# Altium project DATN_Project.PrjPcb
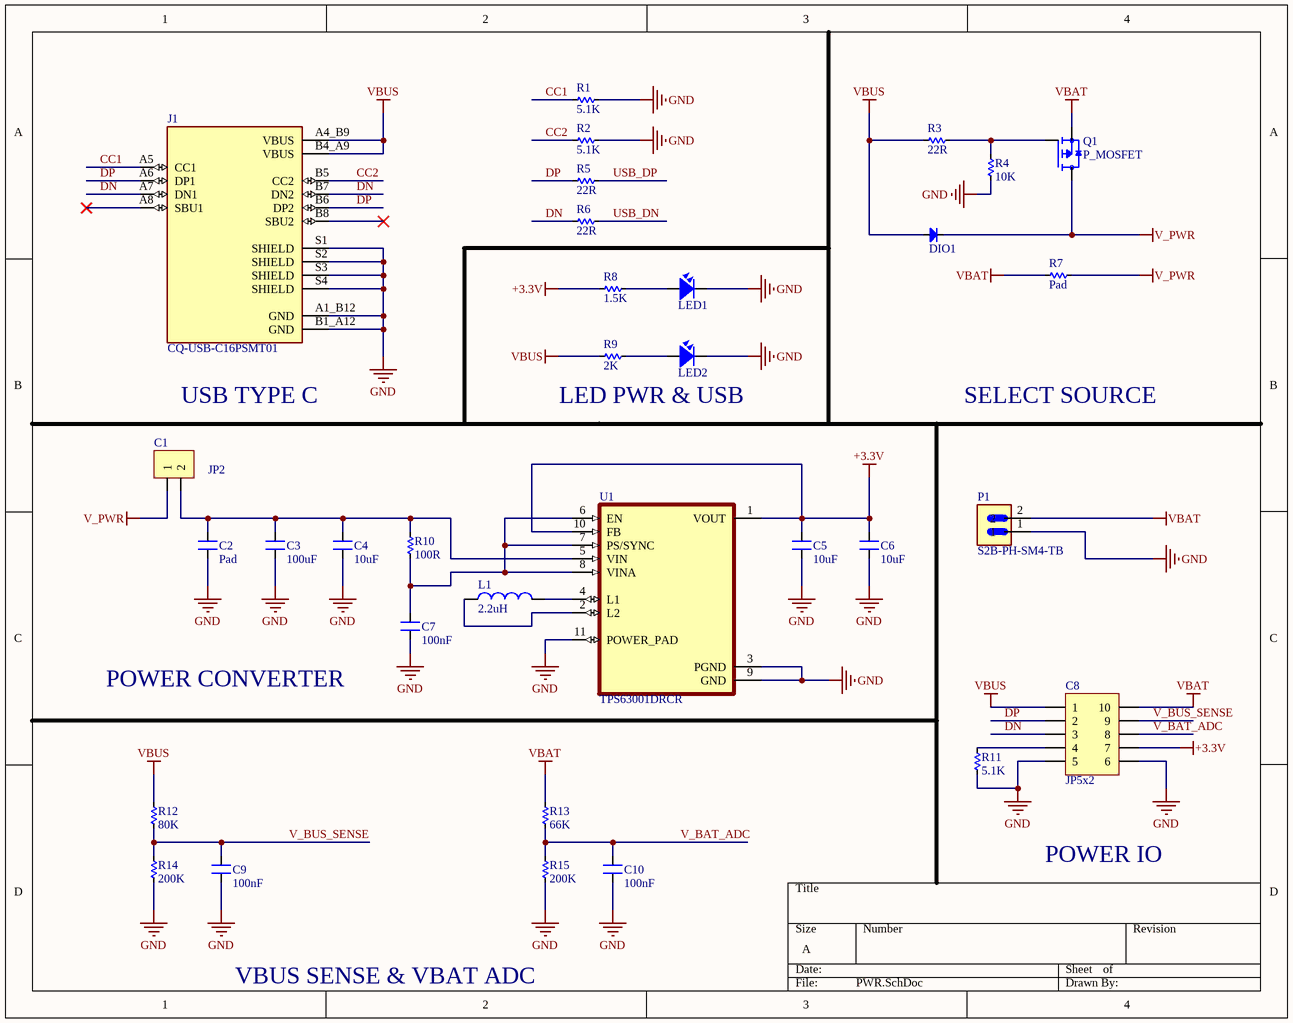
[diagram p0: PWR.SchDoc]
3 sheets, 103 parts. Net scope: global (net labels, ports and power ports of the same name join across sheets).
Board file: DATN_PCB_ver1.PcbDoc
Sheets:
  PWR.SchDoc
  MCU.SchDoc
  GPS_LORA_IMU.SchDoc

## Sheet PWR.SchDoc
size A; SheetNumber: 1; SheetTotal: 3

### Parts
C1  JP2  [JP2-CLOSED]
C2  Pad  [PAD-SMD-1206]
C3  100uF  [CN-SMD-1206]
C4  10uF  [CN-SMD-1206]
C5  10uF  [CN-SMD-1206]
C6  10uF  [CN-SMD-1206]
C7  100nF  [CN-SMD-0603]
C8  JP5x2  [JP5-D2T]
C9  100nF  [CN-SMD-0603]
C10  100nF  [CN-SMD-0603]
DIO1  Diode SMD  [DIO-SMD-123]  (value not drawn)
J1  CQ-USB-C16PSMT01  [SHENZHEN-CHUANGQIN-TECHNOLOGY_CQ-USB-C16PSMT01]
L1  2.2uH  [INDC6060X300]
LED1  LED GREEN  [LED-0805-Green]  (value not drawn)
LED2  LED GREEN  [LED-0805-Blue]  (value not drawn)
P1  S2B-PH-SM4-TB  [JST_S2B-PH-SM4-TB]
Q1  P_MOSFET  [P_MOSFET_SOT23]
R1  5.1K  [RES-SMD-0603]
R2  5.1K  [RES-SMD-0603]
R3  22R  [RES-SMD-0603]
R4  10K  [RES-SMD-0603]
R5  22R  [RES-SMD-0603]
R6  22R  [RES-SMD-0603]
R7  Pad  [PAD-SMD-1206]
R8  1.5K  [RES-SMD-0603]
R9  2K  [RES-SMD-0603]
R10  100R  [RES-SMD-0603]
R11  5.1K  [RES-SMD-0603]
R12  80K  [RES-SMD-0603]
R13  66K  [RES-SMD-0603]
R14  200K  [RES-SMD-0603]
R15  200K  [RES-SMD-0603]
U1  TPS63001DRCR  [VREG_V62/16624-01YE]

### Nets
+3.3V: C5.2 C6.2 C8.7 R8.2 U1.1(VOUT) U1.10(FB)  [project net 3.3V_OUT]
GND: C2.1 C3.1 C4.1 C5.1 C6.1 C7.1 C8.5 C8.6 C9.1 C10.1 J1.A1_B12(GND) J1.B1_A12(GND) J1.S1(SHIELD) J1.S2(SHIELD) J1.S3(SHIELD) J1.S4(SHIELD) LED1.2 LED2.2 P1.1 R1.1 R2.1 R4.2 R11.2 R14.1 R15.1 U1.3(PGND) U1.9(GND) U1.11(POWER_PAD)  [project net GND_OUT]
V_PWR: C1.1 DIO1.2(K) Q1.3(D) R7.2
VBAT: C8.10 P1.2 Q1.2(S) R7.1 R13.2
VBUS: C8.1 DIO1.1(A) J1.A4_B9(VBUS) J1.B4_A9(VBUS) R3.2 R9.2 R12.2
CC1: J1.A5(CC1) R1.2
CC2: J1.B5(CC2) R2.2
DN: C8.3 J1.A7(DN1) J1.B7(DN2) R6.2
DP: C8.2 J1.A6(DP1) J1.B6(DP2) R5.2
USB_DN: R6.1
USB_DP: R5.1
V_BAT_ADC: C8.8 C10.2 R13.1 R15.2
V_BUS_SENSE: C8.9 C9.2 R12.1 R14.2
NetC1_2: C1.2 C2.2 C3.2 C4.2 R10.1 U1.5(VIN)
NetC7_2: C7.2 R10.2 U1.6(EN) U1.7(PS/SYNC) U1.8(VINA)
NetC8_4: C8.4 R11.1
NetL1_1: L1.1 U1.2(L2)
NetL1_2: L1.2 U1.4(L1)
NetLED1_1: LED1.1 R8.1
NetLED2_1: LED2.1 R9.1
NetQ1_1: Q1.1(G) R3.1 R4.1

Not connected (* = marked no-connect by the designer): J1 A8(SBU1)* B8(SBU2)*

### Notes on the sheet
- USB TYPE C
- LED PWR & USB
- SELECT SOURCE
- POWER CONVERTER
- POWER IO
- VBUS SENSE & VBAT ADC

### Library data of the parts
C1 = JP2: WR-PHD 2.54 mm Angled Socket Header; Manufacturer: W¨¹rth Elektronik eiSos GmbH; partNo: 613002143121; ComponentLink1 Description: Manufacturer; ComponentLink2 Description: Datasheet; NoPins: 02; Created Date: 29 March 2013; ComponentLink1URL: http://www.we-online.com; ComponentLink2URL: http://katalog.we-online.de/em/datasheet/6130xx143121.pdf; Created by: Karrer Zheng
C2-C7 C9 C10 = Cap-SMD: Value: 33pF
C8 = JP5x2: WR-PHD 2.54 mm Dual Socket Header; Manufacturer: W¨¹rth Elektronik eiSos GmbH; partNo: 61301021821; ComponentLink1 Description: Manufacturer; ComponentLink2 Description: Datasheet; NoPins: 10; Created Date: 29 March 2013; ComponentLink1URL: http://www.we-online.com; ComponentLink2URL: http://katalog.we-online.de/em/datasheet/6130xx21821.pdf; Created by: Karrer Zheng
DIO1 = Diode SMD: Default Diode; Code - JEDEC: DO-214-AB; Value: 1N5007; Published: 8-Jun-2000; Revision: July-2002: Re-released for DXP Platform.; Publisher: Altium Limited
J1 = CQ-USB-C16PSMT01: C Type USB Type-C Female Plug 16 Pin Connector Power Charger Jack Port; MF: Shenzen Chuangqin Technology; SnapEDA_Link: https://www.snapeda.com/parts/CQ-USB-C16PSMT01/Shenzen+Chuangqin+Technology/view-part/?ref=snap; Package: Package; Value: *; MP: CQ-USB-C16PSMT01; Check_prices: https://www.snapeda.com/parts/CQ-USB-C16PSMT01/Shenzen+Chuangqin+Technology/view-part/?ref=eda
L1 = SMD-Wire-Inductor: INDUCTOR wire-wound; MP: LQW2BAN68NG00L; Package: None; Price: None; Value: *; Availability: Unavailable
LED1 LED2 = LED SMD: Value: LED 3 - 5 ly 2 Colour
P1 = S2B-PH-SM4-TB: Connector Header Surface Mount, Right Angle 2 position 0.079 (2.00mm); MF: JST Sales; SnapEDA_Link: https://www.snapeda.com/parts/S2B-PH-SM4-TB/JST/view-part/?ref=snap; Package: None; Value: *; MP: S2B-PH-SM4-TB; Check_prices: https://www.snapeda.com/parts/S2B-PH-SM4-TB/JST/view-part/?ref=eda
Q1 = P_MOSFET: MF: Diotec Semiconductor; MP: MMFTP3401; SnapEDA_Link: https://www.snapeda.com/parts/MMFTP3401/Diotec/view-part/?ref=snap; Package: SOT-23 Diotec; Value: *; Check_prices: https://www.snapeda.com/parts/MMFTP3401/Diotec/view-part/?ref=eda
R1-R15 = Res-SMD: Resistor; Manufacturer: Generic Components; Class: Passive; Published: 08/06/2000; Publisher: Altium Hobart Technology Centre
U1 = TPS63001DRCR: 96% Buck-Boost Converter with 1.7A Current Switches, 3.3V fixed Output voltage in 3x3 QFN; MF: Texas Instruments; SnapEDA_Link: https://www.snapeda.com/parts/TPS63001DRCR/Texas+Instruments/view-part/?ref=snap; Package: VSON-10 Texas Instruments; Value: *; MP: TPS63001DRCR; Check_prices: https://www.snapeda.com/parts/TPS63001DRCR/Texas+Instruments/view-part/?ref=eda

## Sheet MCU.SchDoc
size A; SheetNumber: 2; SheetTotal: 3
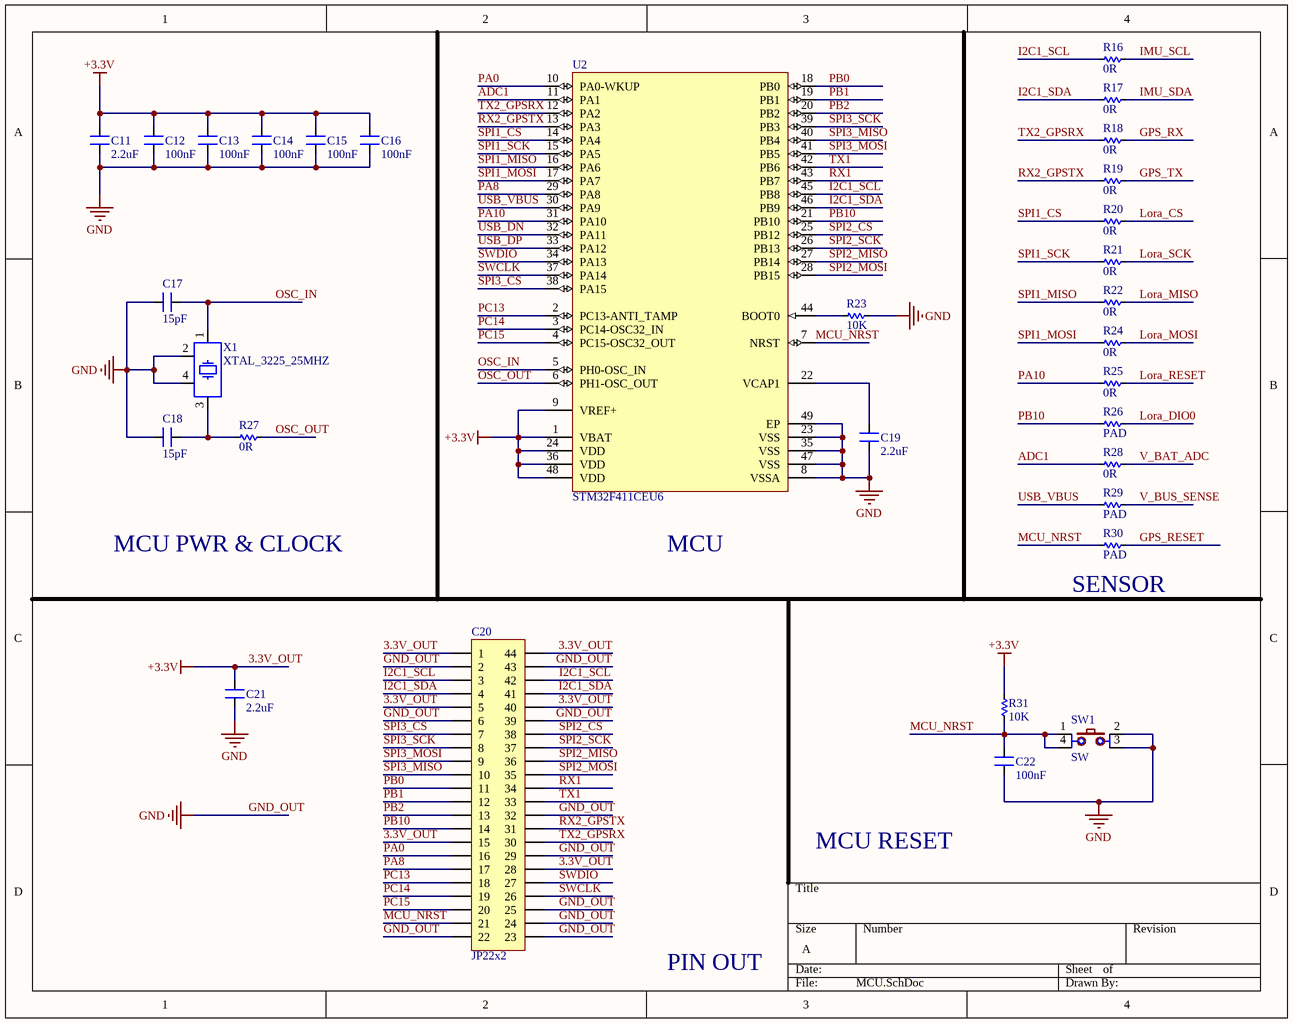
[diagram p1: MCU.SchDoc]

### Parts
C11  2.2uF  [CN-SMD-0805]
C12  100nF  [CN-SMD-0603]
C13  100nF  [CN-SMD-0603]
C14  100nF  [CN-SMD-0603]
C15  100nF  [CN-SMD-0603]
C16  100nF  [CN-SMD-0603]
C17  15pF  [CN-SMD-0603]
C18  15pF  [CN-SMD-0603]
C19  2.2uF  [CN-SMD-0805]
C20  JP22x2  [JP22-D2T]
C21  2.2uF  [CN-SMD-0805]
C22  100nF  [CN-SMD-0603]
R16  0R  [RES-SMD-0603]
R17  0R  [RES-SMD-0603]
R18  0R  [RES-SMD-0603]
R19  0R  [RES-SMD-0603]
R20  0R  [RES-SMD-0603]
R21  0R  [RES-SMD-0603]
R22  0R  [RES-SMD-0603]
R23  10K  [RES-SMD-0603]
R24  0R  [RES-SMD-0603]
R25  0R  [RES-SMD-0603]
R26  PAD  [PAD-RES-SMD-0603]
R27  0R  [RES-SMD-0603]
R28  0R  [RES-SMD-0603]
R29  PAD  [PAD-RES-SMD-0603]
R30  PAD  [PAD-RES-SMD-0603]
R31  10K  [RES-SMD-0603]
SW1  SW  [SW2-SMD]
U2  STM32F411CEU6  [STM-UFQFPN48_L]
X1  XTAL_3225_25MHZ  [XTAL_3225]

### Nets
3.3V_OUT: C11.2 C12.2 C13.2 C14.2 C15.2 C16.2 C20.1 C20.5 C20.15 C20.28 C20.40 C20.44 C21.2 R31.1 U2.1(VBAT) U2.9(VREF+) U2.24(VDD) U2.36(VDD) U2.48(VDD)  [also labelled +3.3V]
GND_OUT: C11.1 C12.1 C13.1 C14.1 C15.1 C16.1 C17.2 C18.2 C19.1 C20.2 C20.6 C20.22 C20.23 C20.24 C20.25 C20.29 C20.32 C20.39 C20.43 C21.1 C22.1 R23.2 SW1.2 SW1.3 U2.8(VSSA) U2.23(VSS) U2.35(VSS) U2.47(VSS) U2.49(EP) X1.2 X1.4  [also labelled GND]
ADC1: R28.1 U2.11(PA1)
GPS_RESET: R30.2
GPS_RX: R18.2
GPS_TX: R19.2
I2C1_SCL: C20.3 C20.42 R16.1 U2.45(PB8)
I2C1_SDA: C20.4 C20.41 R17.1 U2.46(PB9)
IMU_SCL: R16.2
IMU_SDA: R17.2
Lora_CS: R20.2
Lora_DIO0: R26.2
Lora_MISO: R22.2
Lora_MOSI: R24.2
Lora_RESET: R25.2
Lora_SCK: R21.2
MCU_NRST: C20.21 C22.2 R30.1 R31.2 SW1.1 SW1.4 U2.7(NRST)
OSC_IN: C17.1 U2.5(PH0-OSC_IN) X1.1
OSC_OUT: R27.2 U2.6(PH1-OSC_OUT)
PA0: C20.16 U2.10(PA0-WKUP)
PA8: C20.17 U2.29(PA8)
PA10: R25.1 U2.31(PA10)
PB0: C20.11 U2.18(PB0)
PB1: C20.12 U2.19(PB1)
PB2: C20.13 U2.20(PB2)
PB10: C20.14 R26.1 U2.21(PB10)
PC13: C20.18 U2.2(PC13-ANTI_TAMP)
PC14: C20.19 U2.3(PC14-OSC32_IN)
PC15: C20.20 U2.4(PC15-OSC32_OUT)
RX1: C20.34 U2.43(PB7)
RX2_GPSTX: C20.31 R19.1 U2.13(PA3)
SPI1_CS: R20.1 U2.14(PA4)
SPI1_MISO: R22.1 U2.16(PA6)
SPI1_MOSI: R24.1 U2.17(PA7)
SPI1_SCK: R21.1 U2.15(PA5)
SPI2_CS: C20.38 U2.25(PB12)
SPI2_MISO: C20.36 U2.27(PB14)
SPI2_MOSI: C20.35 U2.28(PB15)
SPI2_SCK: C20.37 U2.26(PB13)
SPI3_CS: C20.7 U2.38(PA15)
SPI3_MISO: C20.10 U2.40(PB4)
SPI3_MOSI: C20.9 U2.41(PB5)
SPI3_SCK: C20.8 U2.39(PB3)
SWCLK: C20.26 U2.37(PA14)
SWDIO: C20.27 U2.34(PA13)
TX1: C20.33 U2.42(PB6)
TX2_GPSRX: C20.30 R18.1 U2.12(PA2)
USB_DN: U2.32(PA11)
USB_DP: U2.33(PA12)
USB_VBUS: R29.1 U2.30(PA9)
V_BAT_ADC: R28.2
V_BUS_SENSE: R29.2
NetC18_1: C18.1 R27.1 X1.3
NetC19_2: C19.2 U2.22(VCAP1)
NetR23_1: R23.1 U2.44(BOOT0)

### Notes on the sheet
- MCU PWR & CLOCK
- MCU
- (near R30) SENSOR
- MCU RESET
- PIN OUT

### Library data of the parts
C11-C19 C21 C22 = Cap-SMD: Value: 33pF
C20 = JP22x2: WR-PHD 2.54 mm Dual Socket Header; Manufacturer: W¨¹rth Elektronik eiSos GmbH; partNo: 61304421821; ComponentLink1 Description: Manufacturer; ComponentLink2 Description: Datasheet; NoPins: 44; Created Date: 29 March 2013; ComponentLink1URL: http://www.we-online.com; ComponentLink2URL: http://katalog.we-online.de/em/datasheet/6130xx21821.pdf; Created by: Karrer Zheng
R16-R31 = Res-SMD: as R1 on sheet PWR; Published: 08/06/2000; Publisher: Altium Hobart Technology Centre
SW1 = SW4: Switch button 4 pin; Value: Button chip 4 pin
U2 = STM32F411CEU6: ARM Cortex-M4 32-bit MCU+FPU, 512 KB Flash, 128 KB RAM, 36 I/Os, 48-Pin UFQFPN, -40 to 85 degC, Tray; Operating Frequency(F) (Processor speed) (MHz): 100; FLASH Size (Prog) (kB): 512; Internal RAM Size (kB): 128; I/Os (High Current): 36; Supply Voltage(Vcc) min (V): 1.7; Package Reference: 48-Pin Ultra Thin Fine Pitch Quad Flat No-Lead, 7 x 7 x 0.6 mm Body, 0.5 mm Pitch, Exposed Pad; ComponentLink1Description: Manufacturer URL; ComponentLink1URL: http://www.st.com/; Packing: Tray; Package Description: UFQFPN48; Core: ARM Cortex-M4; ComponentLink2Description: Datasheet; ComponentLink2URL: http://www.st.com/st-web-ui/static/active/en/resource/technical/document/datasheet/DM00115249.pdf; DatasheetVersion: Rev. 6; Mounting Technology: Surface Mount
X1 = XTAL 4 Pin: Crystal Oscillator; Distributor Link: *

## Sheet GPS_LORA_IMU.SchDoc
size A; SheetNumber: 3; SheetTotal: 3
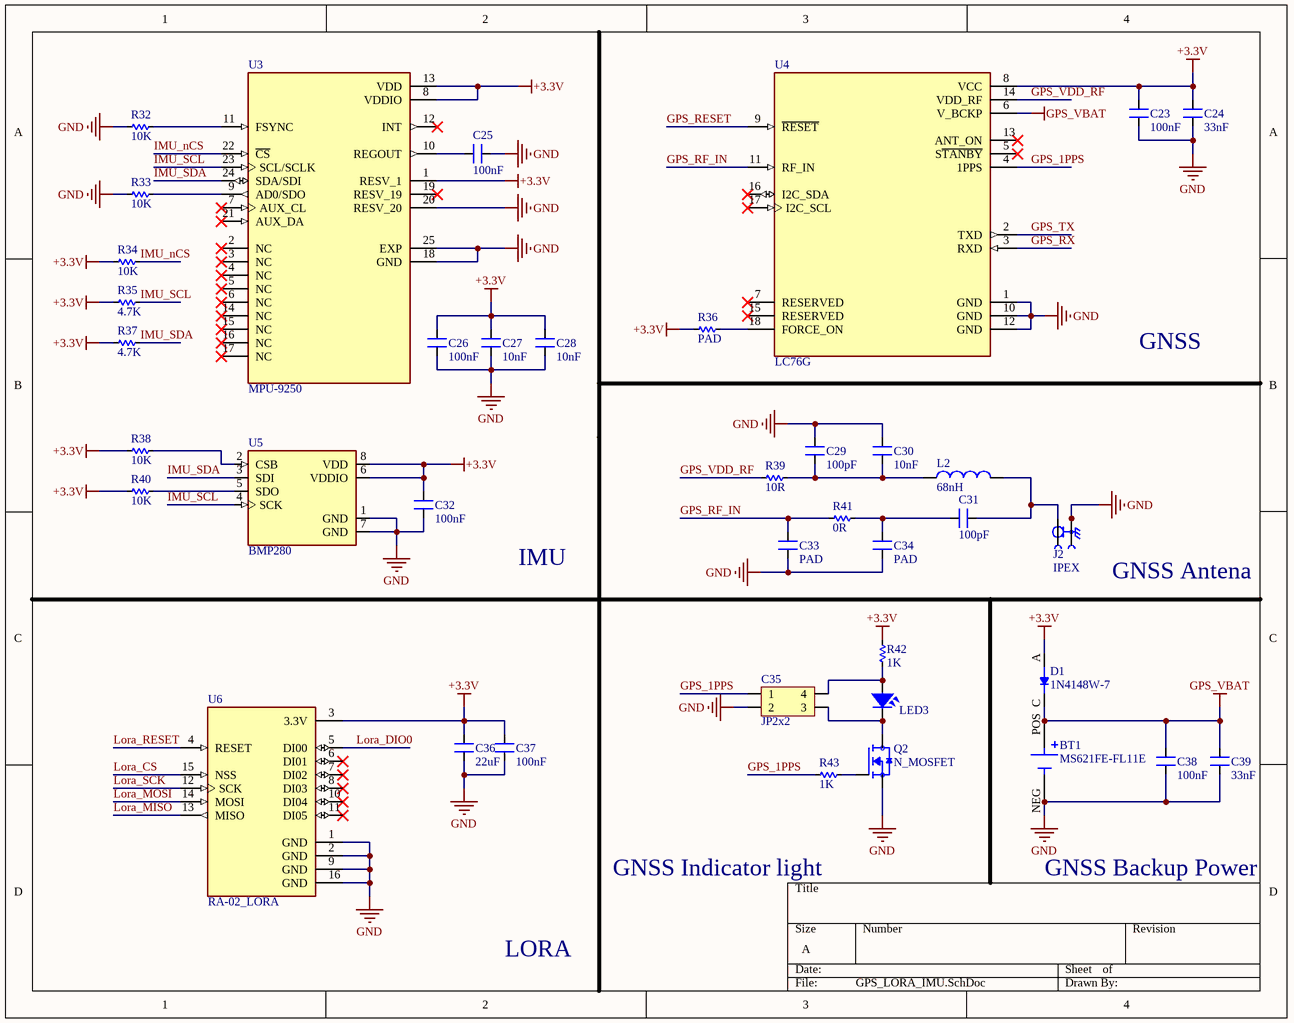
[diagram p2: GPS_LORA_IMU.SchDoc]

### Parts
BT1  MS621FE-FL11E  [BAT_MS621FE-FL11E]
C23  100nF  [CN-SMD-0603]
C24  33nF  [CN-SMD-0603]
C25  100nF  [CN-SMD-0603]
C26  100nF  [CN-SMD-0603]
C27  10nF  [CN-SMD-0603]
C28  10nF  [CN-SMD-0603]
C29  100pF  [CN-SMD-0603]
C30  10nF  [CN-SMD-0603]
C31  100pF  [CN-SMD-0603]
C32  100nF  [CN-SMD-0603]
C33  PAD  [PAD-CAP-SMD-0603]
C34  PAD  [PAD-CAP-SMD-0603]
C35  JP2x2  [JP2-D2T]
C36  22uF  [CN-SMD-1206]
C37  100nF  [CN-SMD-0603]
C38  100nF  [CN-SMD-0603]
C39  33nF  [CN-SMD-0603]
D1  1N4148W-7  [SOD3715X135N]
J2  IPEX  [IPEX_20279-001E-03]
L2  68nH  [SMD_Inductor_0603]
LED3  LED  [LED-0805-Green]  (value not drawn)
Q2  N_MOSFET  [SOT-23-3]
R32  10K  [RES-SMD-0603]
R33  10K  [RES-SMD-0603]
R34  10K  [RES-SMD-0603]
R35  4.7K  [RES-SMD-0603]
R36  PAD  [PAD-RES-SMD-0603]
R37  4.7K  [RES-SMD-0603]
R38  10K  [RES-SMD-0603]
R39  10R  [RES-SMD-0603]
R40  10K  [RES-SMD-0603]
R41  0R  [RES-SMD-0603]
R42  1K  [RES-SMD-0603]
R43  1K  [RES-SMD-0603]
U3  MPU-9250  [QFN40P300X300X105-25N]
U4  LC76G  [XCVR_LC76G]
U5  BMP280  [XDCR_BMP280]
U6  RA-02_LORA  [MODULE_RA-02_LORA]

### Nets
+3.3V: C23.2 C24.2 C26.2 C27.2 C28.2 C32.2 C36.2 C37.2 D1.A R34.1 R35.1 R36.2 R37.1 R38.2 R40.2 R42.2 U3.1(RESV_1) U3.8(VDDIO) U3.13(VDD) U4.8(VCC) U5.6(VDDIO) U5.8(VDD) U6.3(3.3V)  [project net 3.3V_OUT]
GND: BT1.NEG C23.1 C24.1 C25.2 C26.1 C27.1 C28.1 C29.2 C30.2 C32.1 C33.2 C34.2 C35.2 C36.1 C37.1 C38.1 C39.1 J2.2(GROUND) J2.3(GROUND) Q2.2(S) R32.2 R33.2 U3.18(GND) U3.20(RESV_20) U3.25(EXP) U4.1(GND) U4.10(GND) U4.12(GND) U5.1(GND) U5.7(GND) U6.1(GND) U6.2(GND) U6.9(GND) U6.16(GND)  [project net GND_OUT]
GPS_VBAT: BT1.POS C38.2 C39.2 D1.C(K) U4.6(V_BCKP)
GPS_1PPS: C35.1 R43.1 U4.4(1PPS)
GPS_RESET: U4.9(~{RESET})
GPS_RF_IN: C33.1 R41.2 U4.11(RF_IN)
GPS_RX: U4.3(RXD)
GPS_TX: U4.2(TXD)
GPS_VDD_RF: R39.2 U4.14(VDD_RF)
IMU_nCS: R34.2 U3.22(~{CS})
IMU_SCL: R35.2 U3.23(SCL/SCLK) U5.4(SCK)
IMU_SDA: R37.2 U3.24(SDA/SDI) U5.3(SDI)
Lora_CS: U6.15(NSS)
Lora_DIO0: U6.5(DI00)
Lora_MISO: U6.13(MISO)
Lora_MOSI: U6.14(MOSI)
Lora_RESET: U6.4(RESET)
Lora_SCK: U6.12(SCK)
NetC25_1: C25.1 U3.10(REGOUT)
NetC29_1: C29.1 C30.1 L2.1 R39.1
NetC31_1: C31.1 J2.1(SIGNAL) L2.2
NetC31_2: C31.2 C34.1 R41.1
NetC35_3: C35.3 LED3.2 Q2.3(D)
NetC35_4: C35.4 LED3.1 R42.1
NetQ2_1: Q2.1(G) R43.2
NetR32_1: R32.1 U3.11(FSYNC)
NetR33_1: R33.1 U3.9(AD0/SDO)
NetR36_1: R36.1 U4.18(FORCE_ON)
NetR38_1: R38.1 U5.2(CSB)
NetR40_1: R40.1 U5.5(SDO)

Not connected (* = marked no-connect by the designer): U3 2(NC)* 3(NC)* 4(NC)* 5(NC)* 6(NC)* 7(AUX_CL)* 12(INT)* 14(NC)* 15(NC)* 16(NC)* 17(NC)* 19(RESV_19)* 21(AUX_DA)*; U4 5(S~{TANBY})* 7(RESERVED)* 13(ANT_ON)* 15(RESERVED)* 16(I2C_SDA)* 17(I2C_SCL)*; U6 6(DI01)* 7(DI02)* 8(DI03)* 10(DI04)* 11(DI05)*

### Notes on the sheet
- GNSS
- IMU
- (near J2) GNSS Antena
- GNSS Indicator light
- GNSS Backup Power
- LORA

### Library data of the parts
BT1 = MS621FE-FL11E: Coin, 6.8mm 3 V Lithium Battery Rechargeable (Secondary) 5.5mAh; MF: Seiko Instruments; Value: *; Purchase-URL: https://pricing.snapeda.com/search/part/MS621FE-FL11E/?ref=eda; Package: QFP-128 Seiko; Availability: In Stock; Check_prices: https://www.snapeda.com/parts/MS621FE-FL11E/Seiko+Instruments/view-part/?ref=eda; Price: None; SnapEDA_Link: https://www.snapeda.com/parts/MS621FE-FL11E/Seiko+Instruments/view-part/?ref=snap; MP: MS621FE-FL11E
C23-C34 C36-C39 = Cap-SMD: Value: 33pF
C35 = JP2x2: WR-PHD 2.54 mm Dual Socket Header; Manufacturer: W¨¹rth Elektronik eiSos GmbH; partNo: 61300421821; ComponentLink1 Description: Manufacturer; ComponentLink2 Description: Datasheet; NoPins: 04; Created Date: 29 March 2013; ComponentLink1URL: http://www.we-online.com; ComponentLink2URL: http://katalog.we-online.de/em/datasheet/6130xx21821.pdf; Created by: Karrer Zheng
D1 = 1N4148W-7: Diode Standard 100 V 300mA (DC) Surface Mount SOD-123; MF: Diodes Inc.; SnapEDA_Link: https://www.snapeda.com/parts/1N4148W-7/Diodes+Inc./view-part/?ref=snap; Package: SOD-123 Fairchild Semiconductor; MP: 1N4148W-7; Check_prices: https://www.snapeda.com/parts/1N4148W-7/Diodes+Inc./view-part/?ref=eda; Purchase-URL: https://pricing.snapeda.com/search/part/1N4148W-7/?ref=eda; Price: None; Value: *; Availability: In Stock
J2 = IPEX: 1 POS Vertical SMD Small form factor with big performance through 6 GHz connector,MHF, RF, micro-coaxial MHF I Receptacle; MF: I-PEX; MP: 20279-001E-03; SnapEDA_Link: https://www.snapeda.com/parts/20279-001E-03/I-PEX/view-part/?ref=snap; Package: None; Value: *; Check_prices: https://www.snapeda.com/parts/20279-001E-03/I-PEX/view-part/?ref=eda
L2 = SMD-Wire-Inductor: INDUCTOR wire-wound; MP: LQW2BAN68NG00L; Package: None; Price: None; Value: *; Availability: Unavailable
LED3 = LED SMD: Value: LED 3 - 5 ly 2 Colour
Q2 = N_MOSFET: MF: Vishay Siliconix; MP: SI2306BDS-T1-GE3; SnapEDA_Link: https://www.snapeda.com/parts/SI2306BDS-T1-GE3/Vishay/view-part/?ref=snap; Package: SOT-23-3 Vishay Siliconix; Value: *; Check_prices: https://www.snapeda.com/parts/SI2306BDS-T1-GE3/Vishay/view-part/?ref=eda
R32-R35 R37 R38 R40 = Res-SMD: Manufacturer: Generic Components; Class: Passive; Published: 08/06/2000; Publisher: Altium Hobart Technology Centre
R36 R39 R41-R43 = Res-SMD: as R1 on sheet PWR; Published: 08/06/2000; Publisher: Altium Hobart Technology Centre
U3 = MPU-9250: MPU-9250 series Accelerometer, Gyroscope, Humidity, Magnetometer, Pressure, Temperature Sensor Evaluation Board; MF: TDK InvenSense; SnapEDA_Link: https://www.snapeda.com/parts/MPU-9250/TDK+InvenSense/view-part/?ref=snap; Package: TFQFN-24 TDK InvenSense; Value: *; MP: MPU-9250; Check_prices: https://www.snapeda.com/parts/MPU-9250/TDK+InvenSense/view-part/?ref=eda
U4 = LC76G: MF: Quectel; Package: None; Price: None; Value: *; MP: LC76G; Availability: Unavailable
U5 = BMP280: BMP280 Absolute Barometric Pressure Sensor for Battery Powered Devices 2 x 2.5mm; Package: None; Availability: Unavailable; MP: BMP280; Value: *; Price: None
U6 = RA-02_LORA: Ra-02 LoRa RF M5Stack Platform Evaluation Expansion Board; Price: None; Availability: Unavailable; MP: RA-02_LORA; Value: *; Package: None

## Nets that join several sheets
3.3V_OUT: PWR (6 pins), MCU (19 pins), GPS_LORA_IMU (23 pins)
GND_OUT: PWR (28 pins), MCU (31 pins), GPS_LORA_IMU (34 pins)
GPS_RESET: MCU (R30.2), GPS_LORA_IMU (U4.9)
GPS_RX: MCU (R18.2), GPS_LORA_IMU (U4.3)
GPS_TX: MCU (R19.2), GPS_LORA_IMU (U4.2)
IMU_SCL: MCU (R16.2), GPS_LORA_IMU (R35.2 U3.23 U5.4)
IMU_SDA: MCU (R17.2), GPS_LORA_IMU (R37.2 U3.24 U5.3)
Lora_CS: MCU (R20.2), GPS_LORA_IMU (U6.15)
Lora_DIO0: MCU (R26.2), GPS_LORA_IMU (U6.5)
Lora_MISO: MCU (R22.2), GPS_LORA_IMU (U6.13)
Lora_MOSI: MCU (R24.2), GPS_LORA_IMU (U6.14)
Lora_RESET: MCU (R25.2), GPS_LORA_IMU (U6.4)
Lora_SCK: MCU (R21.2), GPS_LORA_IMU (U6.12)
USB_DN: PWR (R6.1), MCU (U2.32)
USB_DP: PWR (R5.1), MCU (U2.33)
V_BAT_ADC: PWR (C8.8 C10.2 R13.1 R15.2), MCU (R28.2)
V_BUS_SENSE: PWR (C8.9 C9.2 R12.1 R14.2), MCU (R29.2)